# Altium schematic sheet CTRL_Circuitry.SchDoc: Control Circuitry
size A3; CheckedBy: Nico Bieberich; Author: Nico Bieberich; Organization: Baltic Racing; Address1: Zur Schwedenschanze 15; Address2: Haus 18; Address3: 18435 Stralsund; DocumentNumber: 2; Revision: xx.xx; SheetNumber: 3; SheetTotal: 3; Rules: TODO; SPICEModelCacheROTCYYSS: <root> / <DocumentId>ROTCYYSS</DocumentId> / <CacheFrame Number="0"> / <Model Name="0603_782631131_120ohm" Kind="CKT"> / <Text>******* / .subckt 0603_782631131_120ohm 1 2 / Rp 1 2 172 / Cp 1 2 0.545p / Rs 1 N3 0.12 / L1 N3 2 0.37u / .ends 0603_782631131_120ohm</Text> / </Model> / </CacheFrame> / </root>; ProjectName: Projekt
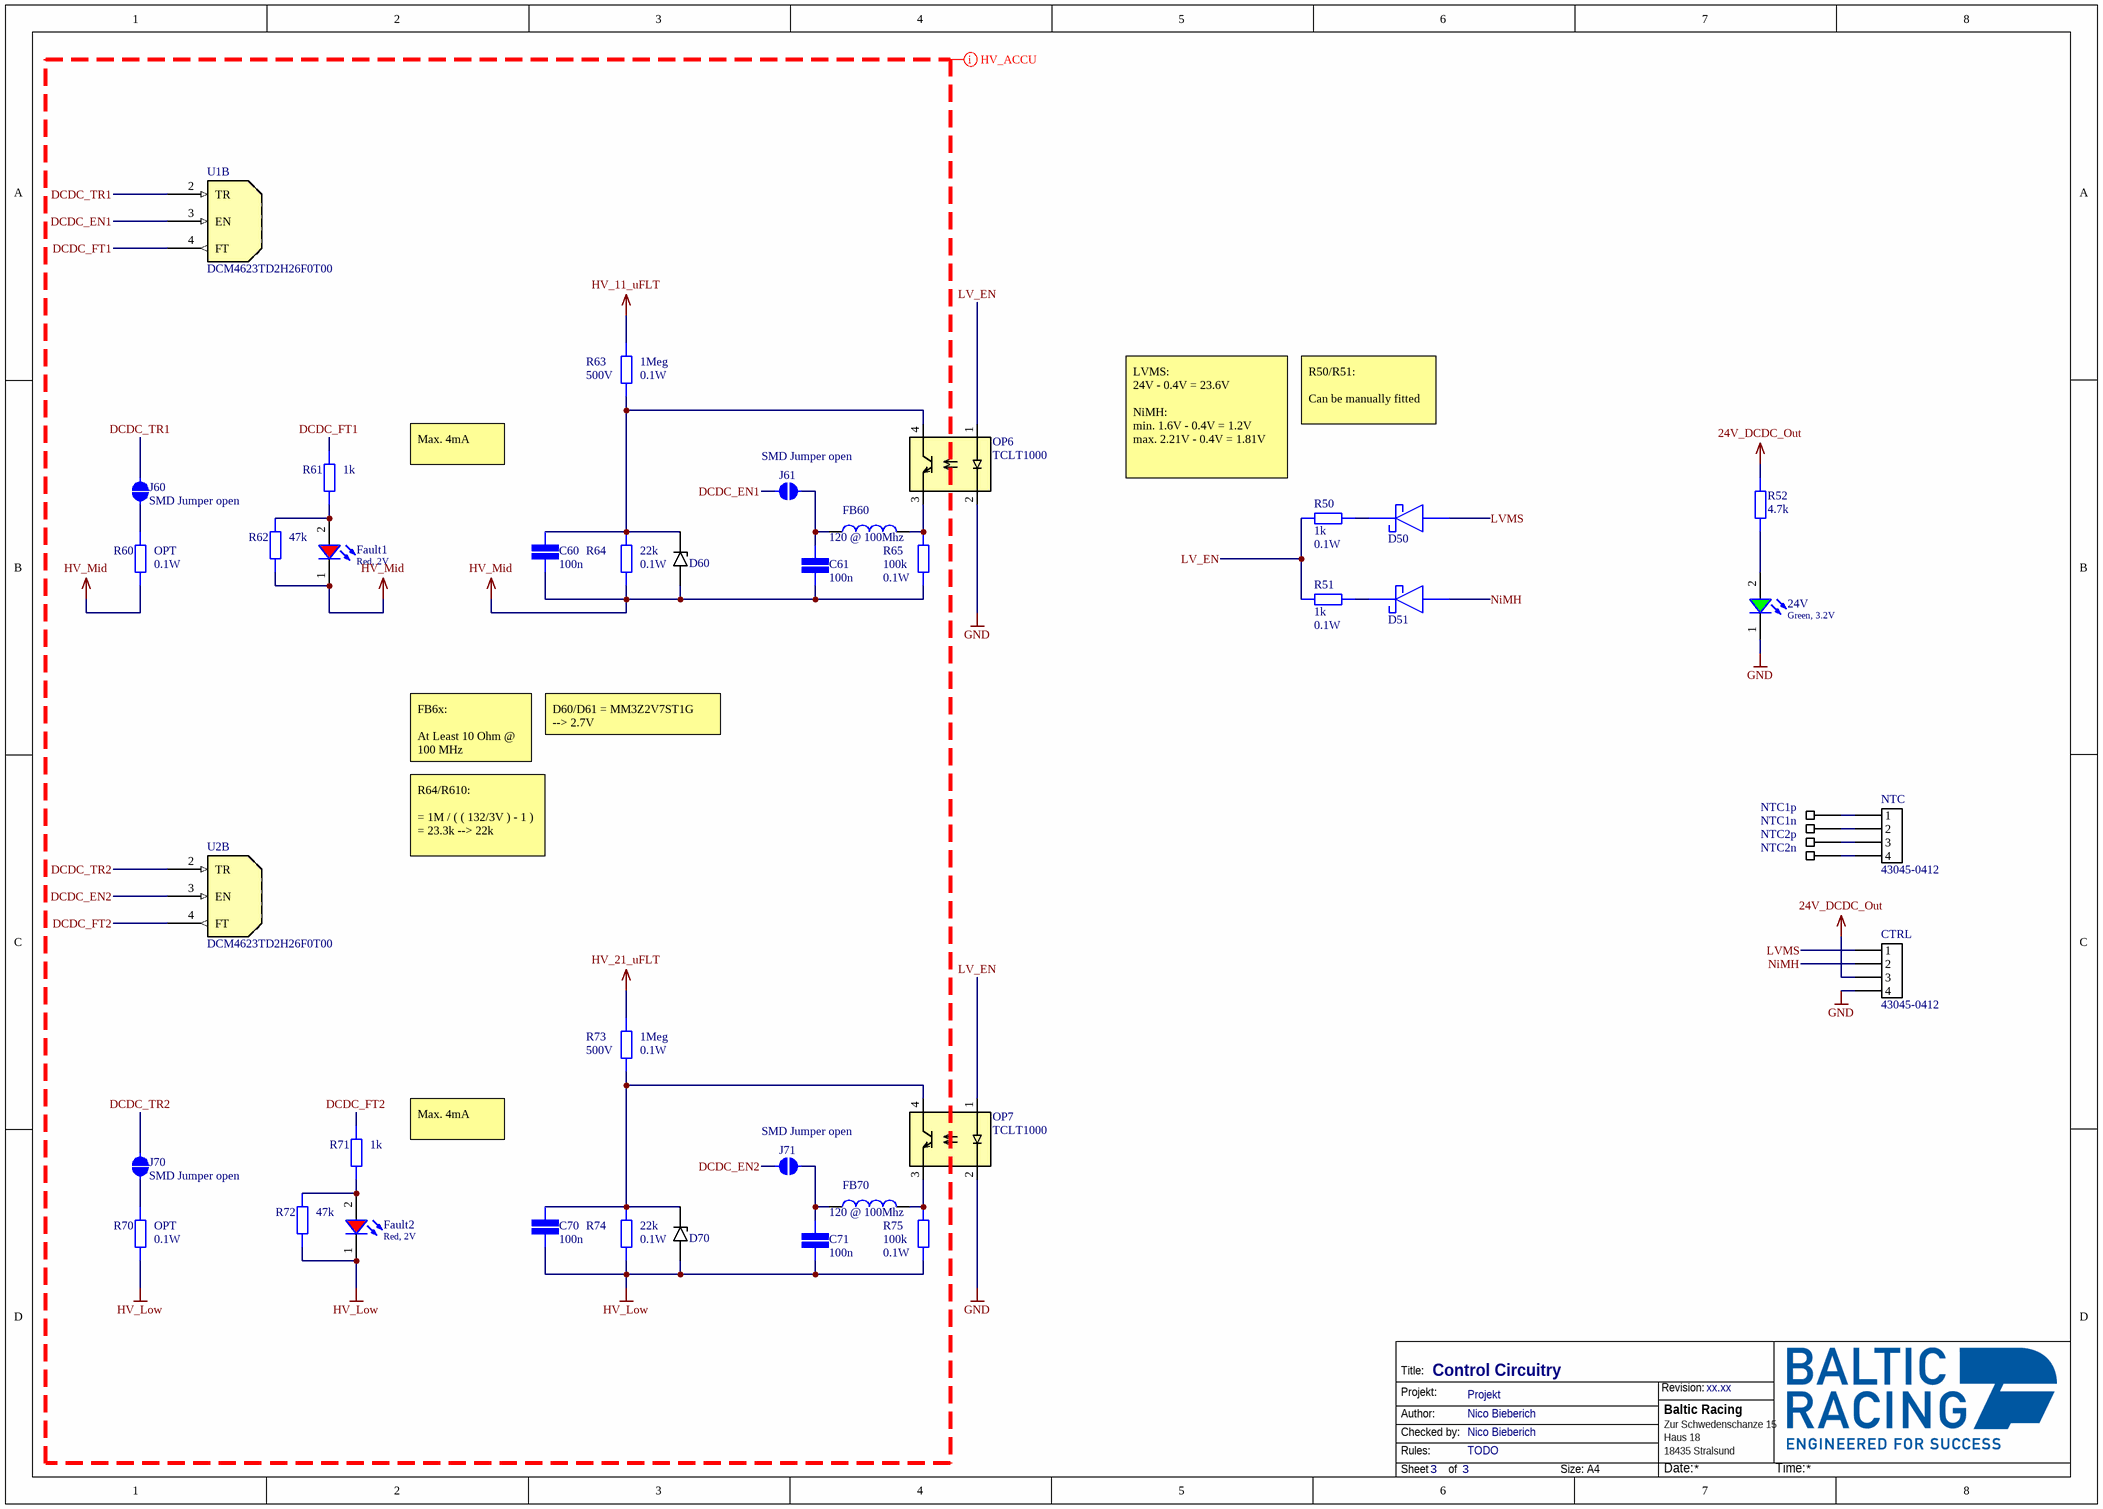
[diagram p0: CTRL_Circuitry.SchDoc]

## Parts
24V  Green, 3.2V  [WL-SMCW_0603_H=0.7mm]
C60  value 100n  [CAP 0603/1608]  (hidden comment: SMD Capacitor)
C61  value 100n  [CAP 0603/1608]  (hidden comment: SMD Capacitor)
C70  value 100n  [CAP 0603/1608]  (hidden comment: SMD Capacitor)
C71  value 100n  [CAP 0603/1608]  (hidden comment: SMD Capacitor)
CTRL  43045-0412  [43045-0412]
D50  CUS521,H3F  [SOD-323-2]  (value not drawn)
D51  CUS521,H3F  [SOD-323-2]  (value not drawn)
D60  MM3Z2V7ST1G  [SOD-323-2]  (value not drawn)
D70  MM3Z2V7ST1G  [SOD-323-2]  (value not drawn)
Fault1  Red, 2V  [WL-SMCW_0603_H=0.7mm]
Fault2  Red, 2V  [WL-SMCW_0603_H=0.7mm]
FB60  120 @ 100Mhz  [WE-CBA_0603_L1.6W0.8H0.8_HF/HS/WB]
FB70  120 @ 100Mhz  [WE-CBA_0603_L1.6W0.8H0.8_HF/HS/WB]
J60  SMD Jumper open  [SMD-JUMPER-OPEN]  (no BOM)
J61  SMD Jumper open  [SMD-JUMPER-OPEN]  (no BOM)
J70  SMD Jumper open  [SMD-JUMPER-OPEN]  (no BOM)
J71  SMD Jumper open  [SMD-JUMPER-OPEN]  (no BOM)
NTC  43045-0412  [43045-0412]
NTC1n  Pad  [Generic_Pad_1.5x1.5]  (value not drawn)
NTC1p  Pad  [Generic_Pad_1.5x1.5]  (value not drawn)
NTC2n  Pad  [Generic_Pad_1.5x1.5]  (value not drawn)
NTC2p  Pad  [Generic_Pad_1.5x1.5]  (value not drawn)
OP6  TCLT1000  [SOP-4L]
OP7  TCLT1000  [SOP-4L]
R50  value 1k  Power: 0.1W  [STACKPOLE CSR0603]  (hidden comment: SMD Resistor)
R51  value 1k  Power: 0.1W  [STACKPOLE CSR0603]  (hidden comment: SMD Resistor)
R52  value 4.7k  [STACKPOLE CSR0603]  (hidden comment: SMD Resistor)
R60  value OPT  Power: 0.1W  [STACKPOLE CSR0603]  (hidden comment: SMD Resistor)
R61  value 1k  [STACKPOLE CSR0603]  (hidden comment: SMD Resistor)
R62  value 47k  [STACKPOLE CSR0603]  (hidden comment: SMD Resistor)
R63  value 1Meg  Voltage: 500V  Power: 0.1W  [STACKPOLE CSRN2512]  (hidden comment: SMD Resistor)
R64  value 22k  Power: 0.1W  [STACKPOLE CSR0603]  (hidden comment: SMD Resistor)
R65  value 100k  Power: 0.1W  [STACKPOLE CSR0603]  (hidden comment: SMD Resistor)
R70  value OPT  Power: 0.1W  [STACKPOLE CSR0603]  (hidden comment: SMD Resistor)
R71  value 1k  [STACKPOLE CSR0603]  (hidden comment: SMD Resistor)
R72  value 47k  [STACKPOLE CSR0603]  (hidden comment: SMD Resistor)
R73  value 1Meg  Voltage: 500V  Power: 0.1W  [STACKPOLE CSRN2512]  (hidden comment: SMD Resistor)
R74  value 22k  Power: 0.1W  [STACKPOLE CSR0603]  (hidden comment: SMD Resistor)
R75  value 100k  Power: 0.1W  [STACKPOLE CSR0603]  (hidden comment: SMD Resistor)
U1  Model: DCM4623TD2H26F0T00  [DCM4623]  (hidden comment: DCM4623)  (part B of 2)
U2  Model: DCM4623TD2H26F0T00  [DCM4623]  (hidden comment: DCM4623)  (part B of 2)

## Nets
24V_DCDC_Out: CTRL.3 R52.2
GND: 24V.1(K) CTRL.4 OP6.2(DC) OP7.2(DC)
HV_11_uFLT: R63.2
HV_21_uFLT: R73.2
HV_Low: C70.1 C71.1 D70.2A(A) Fault2.1(K) R70.1 R72.1 R74.1 R75.1
HV_Mid: C60.1 C61.1 D60.2A(A) Fault1.1(K) R60.1 R62.1 R64.1 R65.1
DCDC_EN1: J61.2 U1.3(EN)
DCDC_EN2: J71.2 U2.3(EN)
DCDC_FT1: R61.2 U1.4(FT)
DCDC_FT2: R71.2 U2.4(FT)
DCDC_TR1: J60.2 U1.2(TR)
DCDC_TR2: J70.2 U2.2(TR)
LV_EN: OP6.1(DA) OP7.1(DA) R50.2 R51.2
LVMS: CTRL.1 D50.2A(A)
NiMH: CTRL.2 D51.2A(A)
Net24V_2: 24V.2(A) R52.1
NetC60_2: C60.2 D60.1C(C) OP6.4(TC) R63.1 R64.2
NetC61_2: C61.2 FB60.1 J61.1
NetC70_2: C70.2 D70.1C(C) OP7.4(TC) R73.1 R74.2
NetC71_2: C71.2 FB70.1 J71.1
NetD50_1C: D50.1C(C) R50.1
NetD51_1C: D51.1C(C) R51.1
NetFault1_2: Fault1.2(A) R61.1 R62.2
NetFault2_2: Fault2.2(A) R71.1 R72.2
NetFB60_2: FB60.2 OP6.3(TE) R65.2
NetFB70_2: FB70.2 OP7.3(TE) R75.2
NetJ60_1: J60.1 R60.2
NetJ70_1: J70.1 R70.2
NetNTC_1: NTC.1 NTC1p.P(Pad)
NetNTC_2: NTC.2 NTC1n.P(Pad)
NetNTC_3: NTC.3 NTC2p.P(Pad)
NetNTC_4: NTC.4 NTC2n.P(Pad)

## Layout directives
net class HV_ACCU: DCDC_EN1, DCDC_EN2, DCDC_FT1, DCDC_FT2, DCDC_TR1, DCDC_TR2, HV_11_uFLT, HV_21_uFLT, HV_Low, HV_Mid

## Notes on the sheet
- R50/R51:
  Can be manually fitted
- Max. 4mA
- (near R50) LVMS:
  24V - 0.4V = 23.6V
  NiMH:
  min. 1.6V - 0.4V = 1.2V
  max. 2.21V - 0.4V = 1.81V
- FB6x:
  At Least 10 Ohm @ 100 MHz
- D60/D61 = MM3Z2V7ST1G
  --> 2.7V
- R64/R610:
  = 1M / ( ( 132/3V ) - 1 )
  = 23.3k --> 22k
- Title:
- Projekt:
- Revision:
- Author:
- Rules:
- Checked by:
- Sheet
- of
- Size:
- A4
- Date:
- Time:

## Library data of the parts
24V = 150060GS75000: WL-SMCW SMT Mono-color Chip LED Waterclear, size 0603, Green, 3.2V, 140deg; Chip Technology: InGaN; Dominant Wavelength typ.: 525nm; Luminous Intensity typ.: 430mcd; Peak Wavelength typ.: 515nm; Viewing Angle: 140deg; ComponentLink1Description: Manufacturer; ComponentLink1URL: http://www.we-online.de; ComponentLink2URL: https://www.we-online.com/catalog/datasheet/150060GS75000.pdf; ComponentLink2Description: Datasheet; Forward Voltage typ.: 3.2V; Emitting Color: Green; Mounting Technology: SMT; Operating Temperature: -40 to +85degC; Published Date: December 2019; Part Number: 150060GS75000; Packaging: Tape and Reel; Size: 0603; Publisher: Wurth Elektronik
C60 C61 C70 C71 = SMD Capacitor: Capacitor with multiple Footprints; Voltage: *
CTRL NTC = 43045-0412: Micro-Fit 3.0 Vertical Header, 3.00mm Pitch, Dual Row, 4 Circuits, with PCB Polarizing Peg, Tin, Glow-Wire Capable, Black
D50 D51 = CUS521,H3F: Toshiba CUS521,H3F / Shottky-Diode / Forward: 390mV, Reverse: 30V; ComponentLink1Description: Octopart; ComponentLink1URL: https://octopart.com/cus521%2Ch3f-toshiba-26712463?r=sp
D60 D70 = MM3Z2V7ST1G: onsemi MM3Z2V7ST1G / Z-Diode, 2,7V; ComponentLink1Description: Octopart; ComponentLink1URL: https://octopart.com/mm3z4v7t1g-onsemi-331144?r=sp
Fault1 Fault2 = 150060RS75000: WL-SMCW SMT Mono-color Chip LED Waterclear, size 0603, Red, 2V, 140deg; Chip Technology: AlInGaP; Dominant Wavelength typ.: 625nm; Luminous Intensity typ.: 250mcd; Peak Wavelength typ.: 630nm; Viewing Angle: 140deg; ComponentLink1Description: Manufacturer; ComponentLink1URL: http://www.we-online.de; ComponentLink2URL: https://www.we-online.com/catalog/datasheet/150060RS75000.pdf; ComponentLink2Description: Datasheet; Forward Voltage typ.: 2V; Emitting Color: Red; Mounting Technology: SMT; Operating Temperature: -40 to +85degC; Published Date: December 2019; Part Number: 150060RS75000; Packaging: Tape and Reel; Size: 0603; Publisher: Wurth Elektronik
FB60 FB70 = 782631131: WE-CBA SMT EMI Suppression Ferrite Bead, size 0603, 120Ohm, 0.5A; Manufacturer: Wurth Elektronik; Case/Size Code: 0603; DC Resistance Max: 0.12Ohm; Impedance Max: 200Ohm; Type: Wide Band; Manufacturer Part Number: 782631131; Category: Ferrites for PCB Assembly; Match Code: WE-CBA; ComponentLink1Description: Website Link; ComponentLink1URL: https://www.we-online.com/redexpert/article/782631131?ad; ComponentLink2Description: Datasheet Link; ComponentLink2URL: https://www.we-online.com/redexpert/spec/782631131?ad; Mount: Surface Mount; Operating Temperature Max: 125°C; Operating Temperature Min: -55°C; Packaging: Tape and Reel; Length: 1.6mm; Width: 0.8mm; Height: 0.8mm; Automotive: Yes; Impedance @100MHz: 120Ohm; Rated Current: 0.5A
NTC1n NTC1p NTC2n NTC2p = Generic_Pad_1.5x1.5: Pad 1.5mm x 1.5mm
OP6 OP7 = TCLT1000: Opto-Isolator / Vishay TLCT100 series / 600V, 5mA, V_ISO= 5 kV (RMS); ComponentLink1Description: Octopart; ComponentLink1URL: https://octopart.com/tclt1000-vishay-55401777?r=sp
R50 R51 R60 R63-R65 R70 R73-R75 = SMD Resistor: Resistor with multiple footprints
R52 = SMD Resistor: Resistor with multiple footprints; Power: 0.1 W
R61 R62 R71 R72 = SMD Resistor: Resistor with multiple footprints; Power: 0.1W
U1 U2 = DCM4623: VICOR DCM® DC-DC Converter Module; ComponentLink1Description: VICOR; ComponentLink1URL: https://www.vicorpower.com/dc-dc/isolated-regulated/dcm